# EAGLE schematic Project_02(Pokey Clicker) (EAGLE 9.6.2)
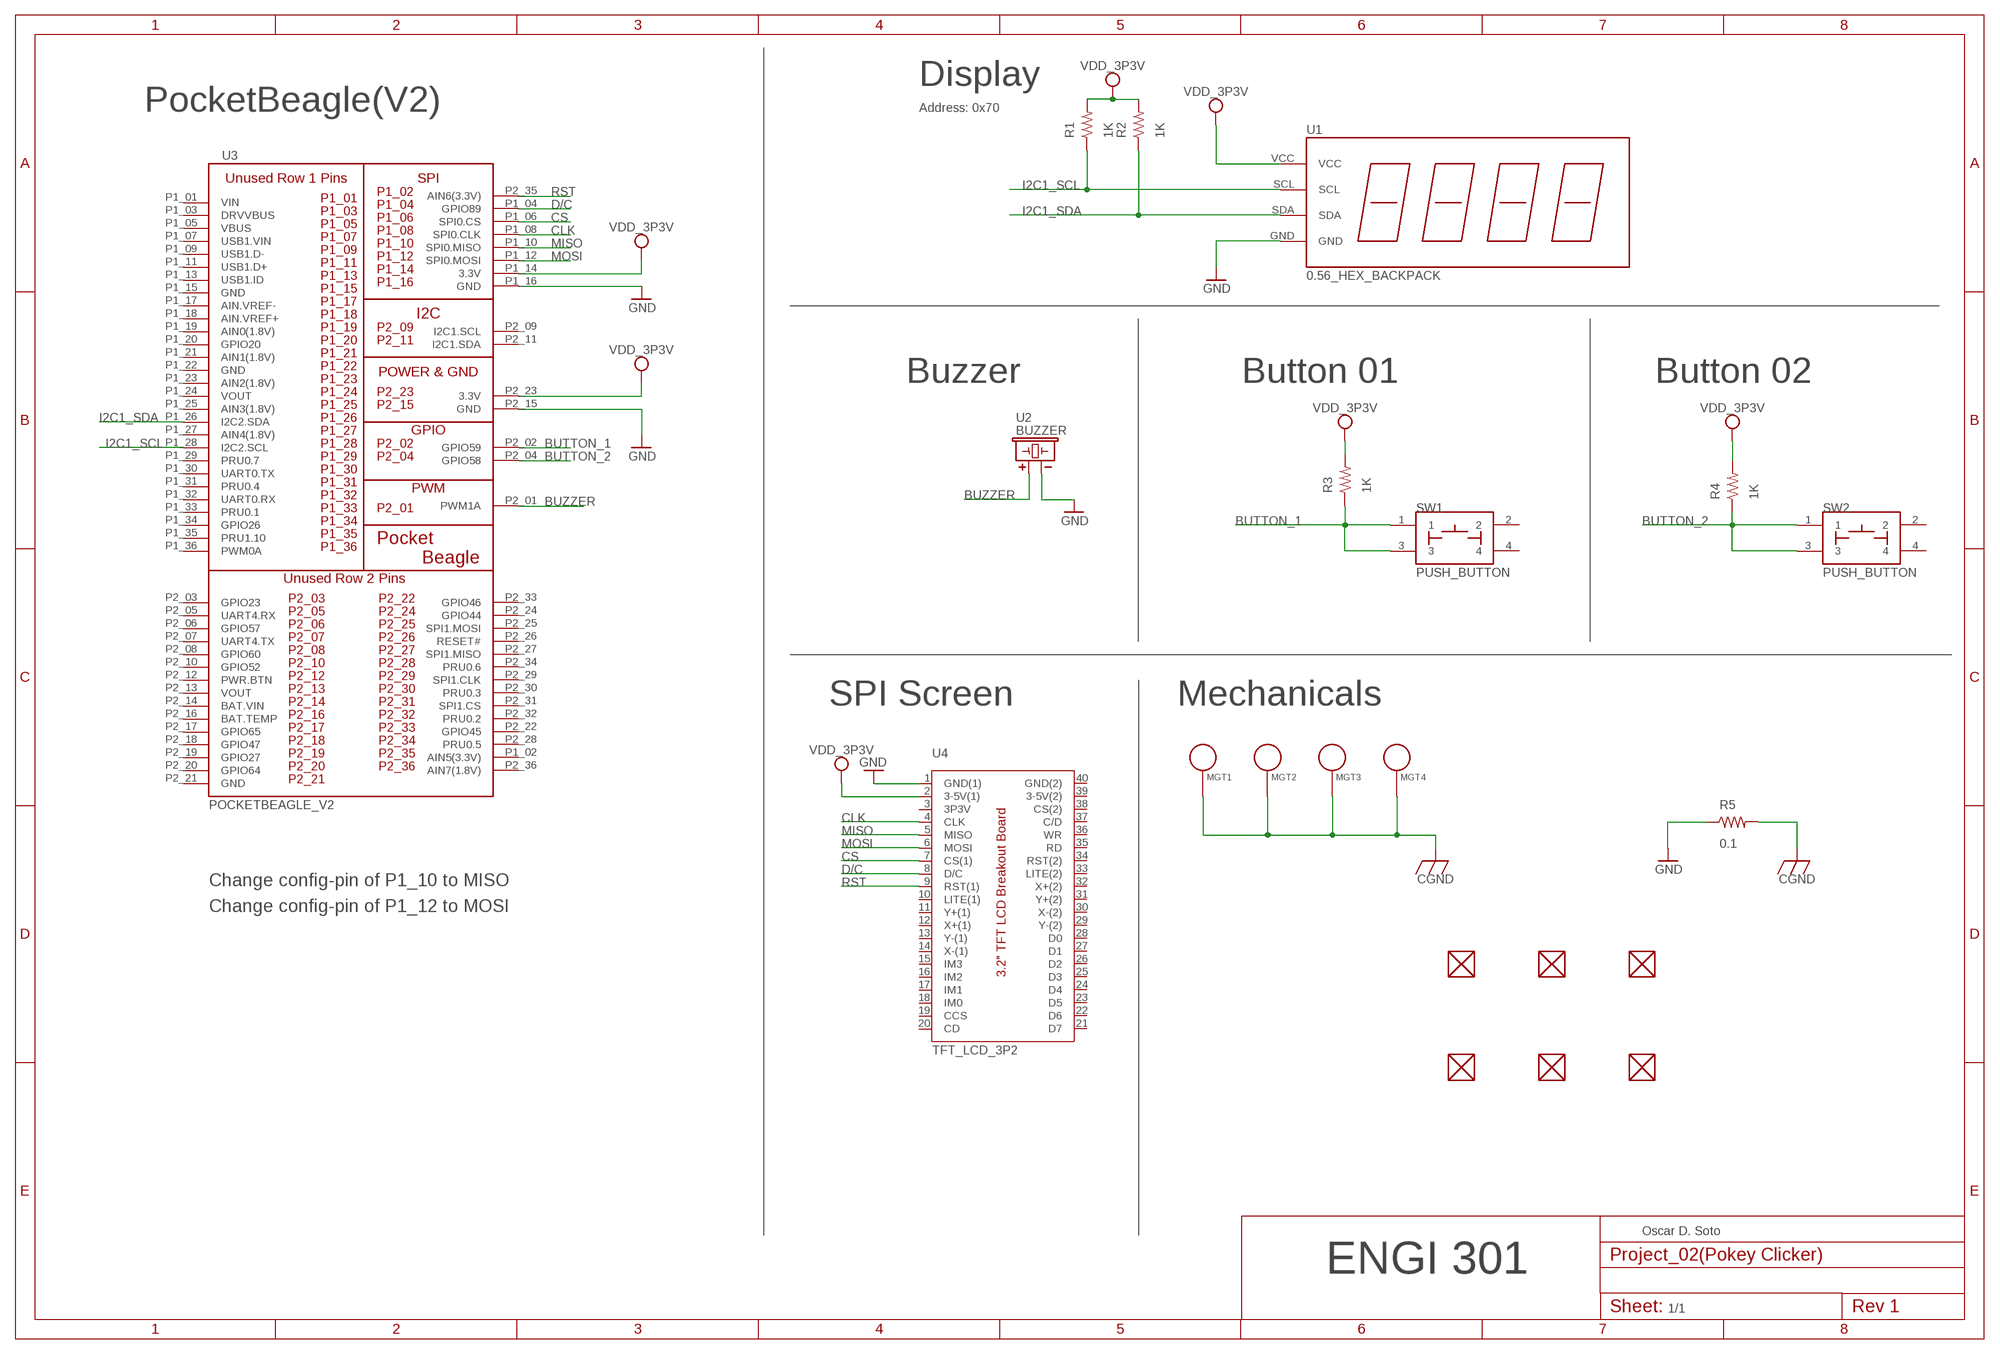
[diagram p0: schematic, sheet 1]

## Parts
FUD1  FIDUCIAL  [FIDUCIAL_40MIL]
FUD2  FIDUCIAL  [FIDUCIAL_40MIL]
FUD3  FIDUCIAL  [FIDUCIAL_40MIL]
FUD4  FIDUCIAL  [FIDUCIAL_40MIL]
FUD5  FIDUCIAL  [FIDUCIAL_40MIL]
FUD6  FIDUCIAL  [FIDUCIAL_40MIL]
MGT1  MOUNTING_HOLE  [MOUNTING_HOLE]
MGT2  MOUNTING_HOLE  [MOUNTING_HOLE]
MGT3  MOUNTING_HOLE  [MOUNTING_HOLE]
MGT4  MOUNTING_HOLE  [MOUNTING_HOLE]
R1  1K  R_R0603  [R0603]
R2  1K  R_R0603  [R0603]
R3  1K  R_R0603  [R0603]
R4  1K  R_R0603  [R0603]
R5  0.1  R_R1206  [R1206]
SW1  PUSH_BUTTON  [BUTTON_12.5MM]
SW2  PUSH_BUTTON  [BUTTON_12.5MM]
U1  0.56_HEX_BACKPACK  [0.56_HEX_BACKPACK]
U2  BUZZER  [BUZZER_6.5MM]
U3  POCKETBEAGLE_V2  [POCKETBEAGLE]
U4  TFT_LCD_3P2  [TFT_LCD_3P2]

## Nets
BUTTON_1: R3.1 SW1.1 SW1.3 U3.P2_02(GPIO59)
BUTTON_2: R4.1 SW2.1 SW2.3 U3.P2_04(GPIO58)
BUZZER: U2.+ U3.P2_01(PWM1A)
CGND: MGT1.P$1 MGT2.P$1 MGT3.P$1 MGT4.P$1 R5.2
CLK: U3.P1_08(SPI0.CLK) U4.4(CLK)
CS: U3.P1_06(SPI0.CS) U4.7(CS(1))
D/C: U3.P1_04(GPIO89) U4.8(D/C)
GND: R5.1 U1.GND U2.- U3.P1_16(GND) U3.P2_15(GND) U4.1(GND(1))
I2C1_SCL: R1.1 U1.SCL U3.P1_28(I2C2.SCL)
I2C1_SDA: R2.1 U1.SDA U3.P1_26(I2C2.SDA)
MISO: U3.P1_10(SPI0.MISO) U4.5(MISO)
MOSI: U3.P1_12(SPI0.MOSI) U4.6(MOSI)
RST: U3.P2_35(AIN6(3.3V)) U4.9(RST(1))
VDD_3P3V: R1.2 R2.2 R3.2 R4.2 U1.VCC U3.P1_14(3.3V) U3.P2_23(3.3V) U4.2(3-5V(1))
Unconnected: FUD1.P$1 FUD2.P$1 FUD3.P$1 FUD4.P$1 FUD5.P$1 FUD6.P$1 SW1.2 SW1.4 SW2.2 SW2.4 U3.P1_02(AIN5(3.3V)) U3.P1_03(DRVVBUS) U3.P1_05(VBUS) U3.P1_07(USB1.VIN) U3.P1_09(USB1.D-) U3.P1_11(USB1.D+) U3.P1_13(USB1.ID) U3.P1_15(GND) U3.P1_17(AIN.VREF-) U3.P1_18(AIN.VREF+) U3.P1_19(AIN0(1.8V)) U3.P1_20(GPIO20) U3.P1_21(AIN1(1.8V)) U3.P1_23(AIN2(1.8V)) U3.P1_25(AIN3(1.8V)) U3.P1_27(AIN4(1.8V)) U3.P1_29(PRU0.7) U3.P1_30(UART0.TX) U3.P1_31(PRU0.4) U3.P1_32(UART0.RX) U3.P1_33(PRU0.1) U3.P1_34(GPIO26) U3.P1_35(PRU1.10) U3.P1_36(PWM0A) U3.P2_03(GPIO23) U3.P2_05(UART4.RX) U3.P2_06(GPIO57) U3.P2_07(UART4.TX) U3.P2_08(GPIO60) U3.P2_09(I2C1.SCL) U3.P2_10(GPIO52) U3.P2_11(I2C1.SDA) U3.P2_12(PWR.BTN) U3.P2_16(BAT.TEMP) U3.P2_17(GPIO65) U3.P2_18(GPIO47) U3.P2_19(GPIO27) U3.P2_20(GPIO64) U3.P2_22(GPIO45) U3.P2_24(GPIO44) U3.P2_25(SPI1.MOSI) U3.P2_26(RESET#) U3.P2_27(SPI1.MISO) U3.P2_28(PRU0.5) U3.P2_29(SPI1.CLK) U3.P2_30(PRU0.3) U3.P2_31(SPI1.CS) U3.P2_32(PRU0.2) U3.P2_33(GPIO46) U3.P2_34(PRU0.6) U3.P2_36(AIN7(1.8V)) U4.3(3P3V) U4.10(LITE(1)) U4.11(Y+(1)) U4.12(X+(1)) U4.13(Y-(1)) U4.14(X-(1)) U4.15(IM3) U4.16(IM2) U4.17(IM1) U4.18(IM0) U4.19(CCS) U4.20(CD) U4.21(D7) U4.22(D6) U4.23(D5) U4.24(D4) U4.25(D3) U4.26(D2) U4.27(D1) U4.28(D0) U4.29(Y-(2)) U4.30(X-(2)) U4.31(Y+(2)) U4.32(X+(2)) U4.33(LITE(2)) U4.34(RST(2)) U4.35(RD) U4.36(WR) U4.37(C/D) U4.38(CS(2)) U4.39(3-5V(2)) U4.40(GND(2))

## Notes on the sheet
- Display
- PocketBeagle(V2) | Address: 0x70
- Buzzer | Button 01 | Button 02
- SPI Screen | Mechanicals
- Change config-pin of P1_10 to MISO
- Change config-pin of P1_12 to MOSI
- Oscar D. Soto
- ENGI 301
- 1/1

## Power pins joined to a net without a drawn wire
BAT.VIN: U3.P2_14(BAT.VIN)
GND: U3.P1_22(GND) U3.P2_21(GND)
VIN: U3.P1_01(VIN)
VOUT: U3.P1_24(VOUT) U3.P2_13(VOUT)

## Library data of the parts
FUD1-FUD6 = Project_02(Pokey_Clicker):FIDUCIAL
MGT1-MGT4 = Project_02(Pokey_Clicker):MOUNTING_HOLE: Chassis Mounting Hole w/GND connection ability
R1-R5 = Project_02(Pokey_Clicker):R_: RESISTOR, American symbol
SW1 SW2 = Project_02(Pokey_Clicker):PUSH_BUTTON
U1 = Project_02(Pokey_Clicker):0.56_HEX_BACKPACK: 0.56" LED HEX Backback - Adafruit HT16K33 - https://www.adafruit.com/product/878 - https://www.adafruit.com/product/879 - https://www.adafruit.com/product/880 - https://www.adafruit.com/product/881 - https://www.adafruit.com/product/1002
U2 = Project_02(Pokey_Clicker):BUZZER: CEM-1203 Buzzer
U3 = Project_02(Pokey_Clicker):POCKETBEAGLE_V2: POCKETBEAGLE V2 - Pocketbeagle development board with a pin confguration suited for projects of the same scope as the Pokey Clicker
U4 = Project_02(Pokey_Clicker):TFT_LCD_3P2: Adafruit 3.2" TFT LCD Breakout Board+ 4-Wire Resistive Touchscreen